# Altium schematic sheet Plugs.SchDoc
size A4
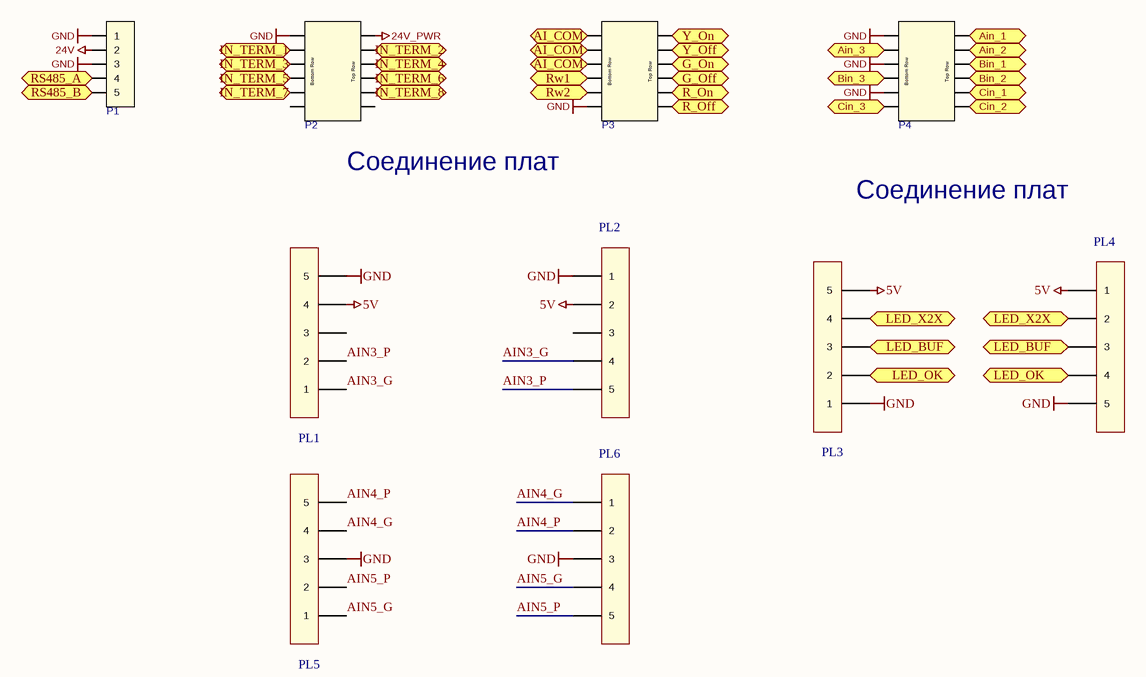
[diagram p0: Plugs.SchDoc]

## Parts
P1  Conncector X2X  [MSTBA-2.5-5-G-5.08]  (value not drawn)
P2  MCD 1,5/6-G1-3,81  [MCD 15.6-G1-3.81]  (value not drawn)
P3  MCD 1,5/6-G1-3,81  [MCD 15.6-G1-3.81]  (value not drawn)
P4  MCD 1,5/6-G1-3,81  [MCD 15.6-G1-3.81]  (value not drawn)
PL1  Pin Line  [PLS-5 2.54]  (value not drawn)
PL2  Pin Line  [PLS-5 2.54]  (value not drawn)
PL3  Pin Line  [PLS-5 2.54]  (value not drawn)
PL4  Pin Line  [PLS-5 2.54]  (value not drawn)
PL5  Pin Line  [PLS-5 2.54]  (value not drawn)
PL6  Pin Line  [PLS-5 2.54]  (value not drawn)

## Ports
AI_COM, Ain_1, Ain_2, Ain_3, Bin_1, Bin_2, Bin_3, Cin_1, Cin_2, Cin_3, G_Off, G_On, IN_TERM_1, IN_TERM_2, IN_TERM_3, IN_TERM_4, IN_TERM_5, IN_TERM_6, IN_TERM_7, IN_TERM_8, LED_BUF, LED_OK, LED_X2X, R_Off, R_On, RS485_A, RS485_B, Rw1, Rw2, Y_Off, Y_On

## Nets
5V: PL1.4 PL2.2 PL3.5 PL4.1
24V: P1.2
24V_PWR: P2.2
GND: P1.1 P1.3 P2.1 P3.11 P4.1 P4.5 P4.9 PL1.5 PL2.1 PL3.1 PL4.5 PL5.3 PL6.3
AI_COM: P3.1 P3.3 P3.5 ; port AI_COM
AIN3_G: PL1.1 PL2.4
AIN3_P: PL1.2 PL2.5
AIN4_G: PL5.4 PL6.1
AIN4_P: PL5.5 PL6.2
AIN5_G: PL5.1 PL6.4
AIN5_P: PL5.2 PL6.5
Ain_1: P4.2 ; port Ain_1
Ain_2: P4.4 ; port Ain_2
Ain_3: P4.3 ; port Ain_3
Bin_1: P4.6 ; port Bin_1
Bin_2: P4.8 ; port Bin_2
Bin_3: P4.7 ; port Bin_3
Cin_1: P4.10 ; port Cin_1
Cin_2: P4.12 ; port Cin_2
Cin_3: P4.11 ; port Cin_3
G_Off: P3.8 ; port G_Off
G_On: P3.6 ; port G_On
IN_TERM_1: P2.3 ; port IN_TERM_1
IN_TERM_2: P2.4 ; port IN_TERM_2
IN_TERM_3: P2.5 ; port IN_TERM_3
IN_TERM_4: P2.6 ; port IN_TERM_4
IN_TERM_5: P2.7 ; port IN_TERM_5
IN_TERM_6: P2.8 ; port IN_TERM_6
IN_TERM_7: P2.9 ; port IN_TERM_7
IN_TERM_8: P2.10 ; port IN_TERM_8
LED_BUF: PL3.3 PL4.3 ; port LED_BUF
LED_OK: PL3.2 PL4.4 ; port LED_OK
LED_X2X: PL3.4 PL4.2 ; port LED_X2X
R_Off: P3.12 ; port R_Off
R_On: P3.10 ; port R_On
RS485_A: P1.4 ; port RS485_A
RS485_B: P1.5 ; port RS485_B
Rw1: P3.7 ; port Rw1
Rw2: P3.9 ; port Rw2
Y_Off: P3.4 ; port Y_Off
Y_On: P3.2 ; port Y_On

Not connected (* = marked no-connect by the designer): P2 11 12; PL1 3; PL2 3

## Notes on the sheet
- (near P2) Соединение плат
- Соединение плат
- (in symbol MCD 1,5/6-G1-3,81) Bottom Row; Top Row

## Library data of the parts
P1 = MSTBA-2.5-5-G-5.08
P2-P4 = MCD 1,5/6-G1-3,81: MCD 1,5/6-G1-3,81 PCB Connector
PL1-PL6 = PLS-5: PLS-5 2.54